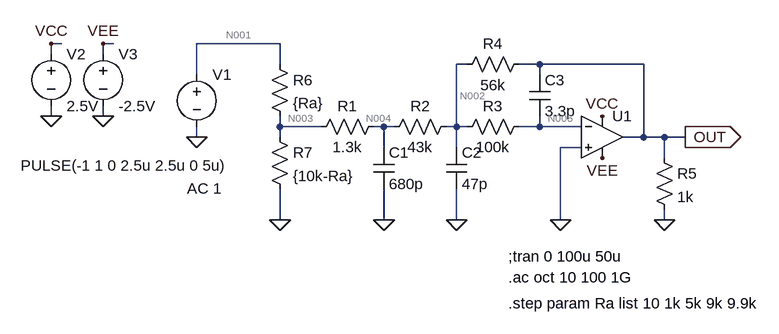
[diagram p0: schematic 3rd Multipule FeedBack with POT.asc]
3rd Multipule FeedBack with POT.asc, the LTspice schematic file:
Version 4
SHEET 1 932 680
WIRE -208 16 -224 16
WIRE -128 16 -144 16
WIRE 128 16 0 16
WIRE -224 32 -224 16
WIRE -144 32 -144 16
WIRE 128 48 128 16
WIRE 416 48 400 48
WIRE 528 48 496 48
WIRE 688 48 528 48
WIRE 0 64 0 16
WIRE 528 64 528 48
WIRE -224 128 -224 112
WIRE -144 128 -144 112
WIRE 128 144 128 128
WIRE 192 144 128 144
WIRE 288 144 272 144
WIRE 304 144 288 144
WIRE 400 144 400 48
WIRE 400 144 384 144
WIRE 416 144 400 144
WIRE 528 144 528 128
WIRE 528 144 496 144
WIRE 592 144 528 144
WIRE 0 160 0 144
WIRE 128 160 128 144
WIRE 688 160 688 48
WIRE 688 160 656 160
WIRE 720 160 688 160
WIRE 752 160 720 160
WIRE 288 176 288 144
WIRE 400 176 400 144
WIRE 592 176 560 176
WIRE 720 192 720 160
WIRE 128 288 128 240
WIRE 288 288 288 240
WIRE 400 288 400 240
WIRE 560 288 560 176
WIRE 720 288 720 272
FLAG 0 160 0
FLAG 288 288 0
FLAG 400 288 0
FLAG 560 288 0
FLAG 752 160 OUT
IOPIN 752 160 Out
FLAG 720 288 0
FLAG -224 128 0
FLAG -144 128 0
FLAG -224 16 VCC
FLAG -144 16 VEE
FLAG 624 128 VCC
FLAG 624 192 VEE
FLAG 128 288 0
SYMBOL Opamps\\UniversalOpamp2 624 160 R0
SYMATTR InstName U1
SYMBOL res 288 128 R90
WINDOW 0 0 56 VBottom 2
WINDOW 3 32 56 VTop 2
SYMATTR InstName R1
SYMATTR Value 1.3k
SYMBOL res 400 128 R90
WINDOW 0 0 56 VBottom 2
WINDOW 3 32 56 VTop 2
SYMATTR InstName R2
SYMATTR Value 43k
SYMBOL res 512 128 R90
WINDOW 0 0 56 VBottom 2
WINDOW 3 32 56 VTop 2
SYMATTR InstName R3
SYMATTR Value 100k
SYMBOL res 512 32 R90
WINDOW 0 0 56 VBottom 2
WINDOW 3 32 56 VTop 2
SYMATTR InstName R4
SYMATTR Value 56k
SYMBOL cap 272 176 R0
SYMATTR InstName C1
SYMATTR Value 680p
SYMBOL cap 384 176 R0
SYMATTR InstName C2
SYMATTR Value 47p
SYMBOL cap 512 64 R0
SYMATTR InstName C3
SYMATTR Value 3.3p
SYMBOL voltage 0 48 R0
WINDOW 3 -271 156 Left 2
WINDOW 123 -15 191 Left 2
WINDOW 39 0 0 Left 2
SYMATTR Value PULSE(-1 1 0 2.5u 2.5u 0 5u)
SYMATTR Value2 AC 1
SYMATTR InstName V1
SYMBOL res 704 176 R0
SYMATTR InstName R5
SYMATTR Value 1k
SYMBOL voltage -224 16 R0
WINDOW 123 0 0 Left 2
WINDOW 39 0 0 Left 2
SYMATTR InstName V2
SYMATTR Value 2.5V
SYMBOL voltage -144 16 R0
WINDOW 123 0 0 Left 2
WINDOW 39 0 0 Left 2
SYMATTR InstName V3
SYMATTR Value -2.5V
SYMBOL res 112 32 R0
SYMATTR InstName R6
SYMATTR Value {Ra}
SYMBOL res 112 144 R0
SYMATTR InstName R7
SYMATTR Value {10k-Ra}
TEXT 480 344 Left 2 !;tran 0 100u 50u
TEXT 480 376 Left 2 !.ac oct 10 100 1G
TEXT 480 416 Left 2 !.step param Ra list 10 1k 5k 9k 9.9k

The netlist it stands for:
* 3rd Multipule FeedBack with POT.asc
XU1 0 N005 VCC VEE OUT level.2 Avol=1Meg GBW=10Meg Slew=10Meg ilimit=25m rail=0 Vos=0 phimargin=45 en=0 enk=0 in=0 ink=0 Rin=500Meg  ; pins IN+ IN- V+ V- OUT
R1 N004 N003 1.3k
R2 N002 N004 43k
R3 N005 N002 100k
R4 OUT N002 56k
C1 N004 0 680p
C2 N002 0 47p
C3 OUT N005 3.3p
V1 N001 0 PULSE(-1 1 0 2.5u 2.5u 0 5u) AC 1
R5 OUT 0 1k
V2 VCC 0 2.5V
V3 VEE 0 -2.5V
R6 N001 N003 {Ra}
R7 N003 0 {10k-Ra}
;tran 0 100u 50u
.ac oct 10 100 1G
.step param Ra list 10 1k 5k 9k 9.9k
.lib UniversalOpamps2.sub
.backanno
.end

* Results of the author's LTspice run, read from the files saved beside the schematic
* Operating Point (first step), zero values left out:
*   ra = 10 
*   V(out) = 1.263 V
*   V(vcc) = 2.5 V
*   V(vee) = -2.5 V
*   V(n005) = -1.322 µV
*   V(n004) = -969.5 mV
*   V(n003) = -998.8 mV
*   V(n002) = -1.323 µV
*   V(n001) = -1 V
*   I(R7) = -99.98 µA
*   I(R6) = -122.5 µA
*   I(R5) = 1.263 mA
*   I(R4) = 22.55 µA
*   I(R2) = 22.55 µA
*   I(R1) = 22.55 µA
*   I(V3) = 35.25 µA
*   I(V2) = -1.32 mA
*   I(V1) = 122.5 µA
*   Ix(u1:3) = 1.32 mA
*   Ix(u1:4) = -35.25 µA
*   Ix(u1:5) = -1.285 mA
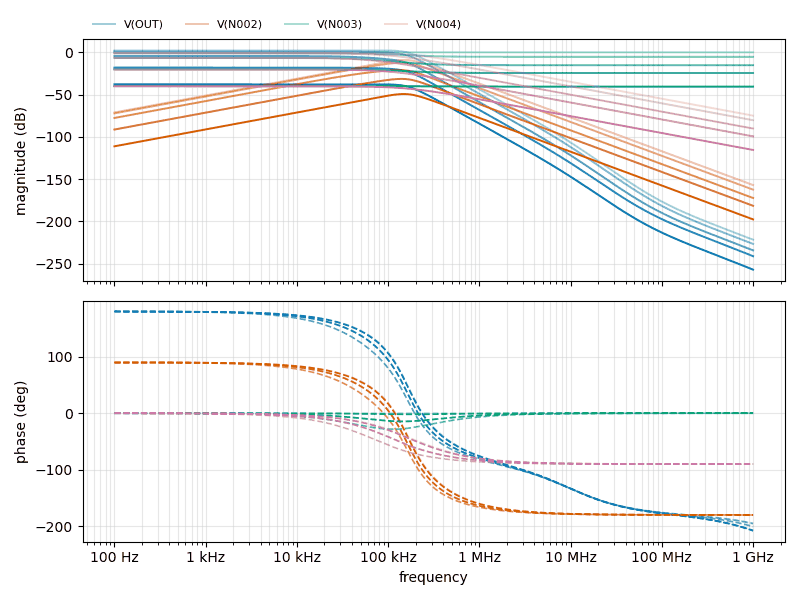
[diagram p1: AC Analysis of 3rd Multipule FeedBack with POT.asc, plotted from the saved traces]
* AC Analysis, 5 runs:
*   V(OUT) [run 1]: 2.03 dB at 100 Hz, -221.62 dB at 1 GHz, peak 2.14 dB at 77.6 kHz, 3 dB below the peak at 169.6 kHz
*   V(OUT) [run 2]: 0.95 dB at 100 Hz, -226.63 dB at 1 GHz, peak 0.95 dB at 100 Hz, 3 dB below the peak at 138.6 kHz
*   V(OUT) [run 3]: -4.46 dB at 100 Hz, -234.24 dB at 1 GHz, peak -4.46 dB at 100 Hz, 3 dB below the peak at 81.99 kHz
*   V(OUT) [run 4]: -18.14 dB at 100 Hz, -241.16 dB at 1 GHz, peak -18.14 dB at 100 Hz, 3 dB below the peak at 138.6 kHz
*   V(OUT) [run 5]: -37.98 dB at 100 Hz, -257.07 dB at 1 GHz, peak -37.94 dB at 67.56 kHz, 3 dB below the peak at 167.4 kHz
*   V(N002) [run 1]: -71.21 dB at 100 Hz, -157.04 dB at 1 GHz, peak -9.22 dB at 144.8 kHz, 3 dB below the peak at 87.96 kHz and 225.4 kHz
*   V(N002) [run 2]: -72.29 dB at 100 Hz, -162.45 dB at 1 GHz, peak -12.47 dB at 135.1 kHz, 3 dB below the peak at 76.21 kHz and 211.6 kHz
*   V(N002) [run 3]: -77.70 dB at 100 Hz, -172.30 dB at 1 GHz, peak -21.00 dB at 126.1 kHz, 3 dB below the peak at 60.94 kHz and 201.9 kHz
*   V(N002) [run 4]: -91.37 dB at 100 Hz, -181.54 dB at 1 GHz, peak -31.55 dB at 135.1 kHz, 3 dB below the peak at 76.2 kHz and 211.6 kHz
*   V(N002) [run 5]: -111.22 dB at 100 Hz, -197.61 dB at 1 GHz, peak -49.44 dB at 144.8 kHz, 3 dB below the peak at 86.76 kHz and 223.3 kHz
*   V(N003) [run 1]: -0.01 dB at 100 Hz, -0.08 dB at 1 GHz, peak -0.01 dB at 100 Hz
*   V(N003) [run 2]: -1.09 dB at 100 Hz, -5.48 dB at 1 GHz, peak -1.09 dB at 100 Hz, 3 dB below the peak at 212.3 kHz
*   V(N003) [run 3]: -6.50 dB at 100 Hz, -15.34 dB at 1 GHz, peak -6.50 dB at 100 Hz, 3 dB below the peak at 79.34 kHz
*   V(N003) [run 4]: -20.17 dB at 100 Hz, -24.57 dB at 1 GHz, peak -20.17 dB at 100 Hz, 3 dB below the peak at 212.3 kHz
*   V(N003) [run 5]: -40.02 dB at 100 Hz, -40.64 dB at 1 GHz, peak -40.02 dB at 100 Hz
*   V(N004) [run 1]: -0.27 dB at 100 Hz, -74.97 dB at 1 GHz, peak -0.27 dB at 100 Hz, 3 dB below the peak at 185.9 kHz
*   V(N004) [run 2]: -1.35 dB at 100 Hz, -80.38 dB at 1 GHz, peak -1.35 dB at 100 Hz, 3 dB below the peak at 114.6 kHz
*   V(N004) [run 3]: -6.76 dB at 100 Hz, -90.23 dB at 1 GHz, peak -6.76 dB at 100 Hz, 3 dB below the peak at 68.53 kHz
*   V(N004) [run 4]: -20.43 dB at 100 Hz, -99.46 dB at 1 GHz, peak -20.43 dB at 100 Hz, 3 dB below the peak at 114.6 kHz
*   V(N004) [run 5]: -40.28 dB at 100 Hz, -115.53 dB at 1 GHz, peak -40.28 dB at 100 Hz, 3 dB below the peak at 174.9 kHz